# Altium schematic sheet FPGA_ADC_DAC.SchDoc: Phaser
size 420 x 297 mm; EDA_Number: ARTIQ; Projet: ARTIQ/SINARA; Author: G.Kasprowicz; CompanyName: WUT ISE; DrawnBy: G.Kasprowicz; Organization: WUT ISE; Address1: PW ISE; Address2: Nowowiejska 15/19 00-665 Warsaw; Address3: gkasprow@gmail.com; DocumentNumber: 8; Revision: 2; SheetNumber: 8; SheetTotal: 18; ModifiedBy: -; CheckedDate: -; Title2: FPGA DAC; DivGrp: WUT ISE; Designer: G.Kasprowicz; ModifiedDate: -; ProjectName: Sensor Box
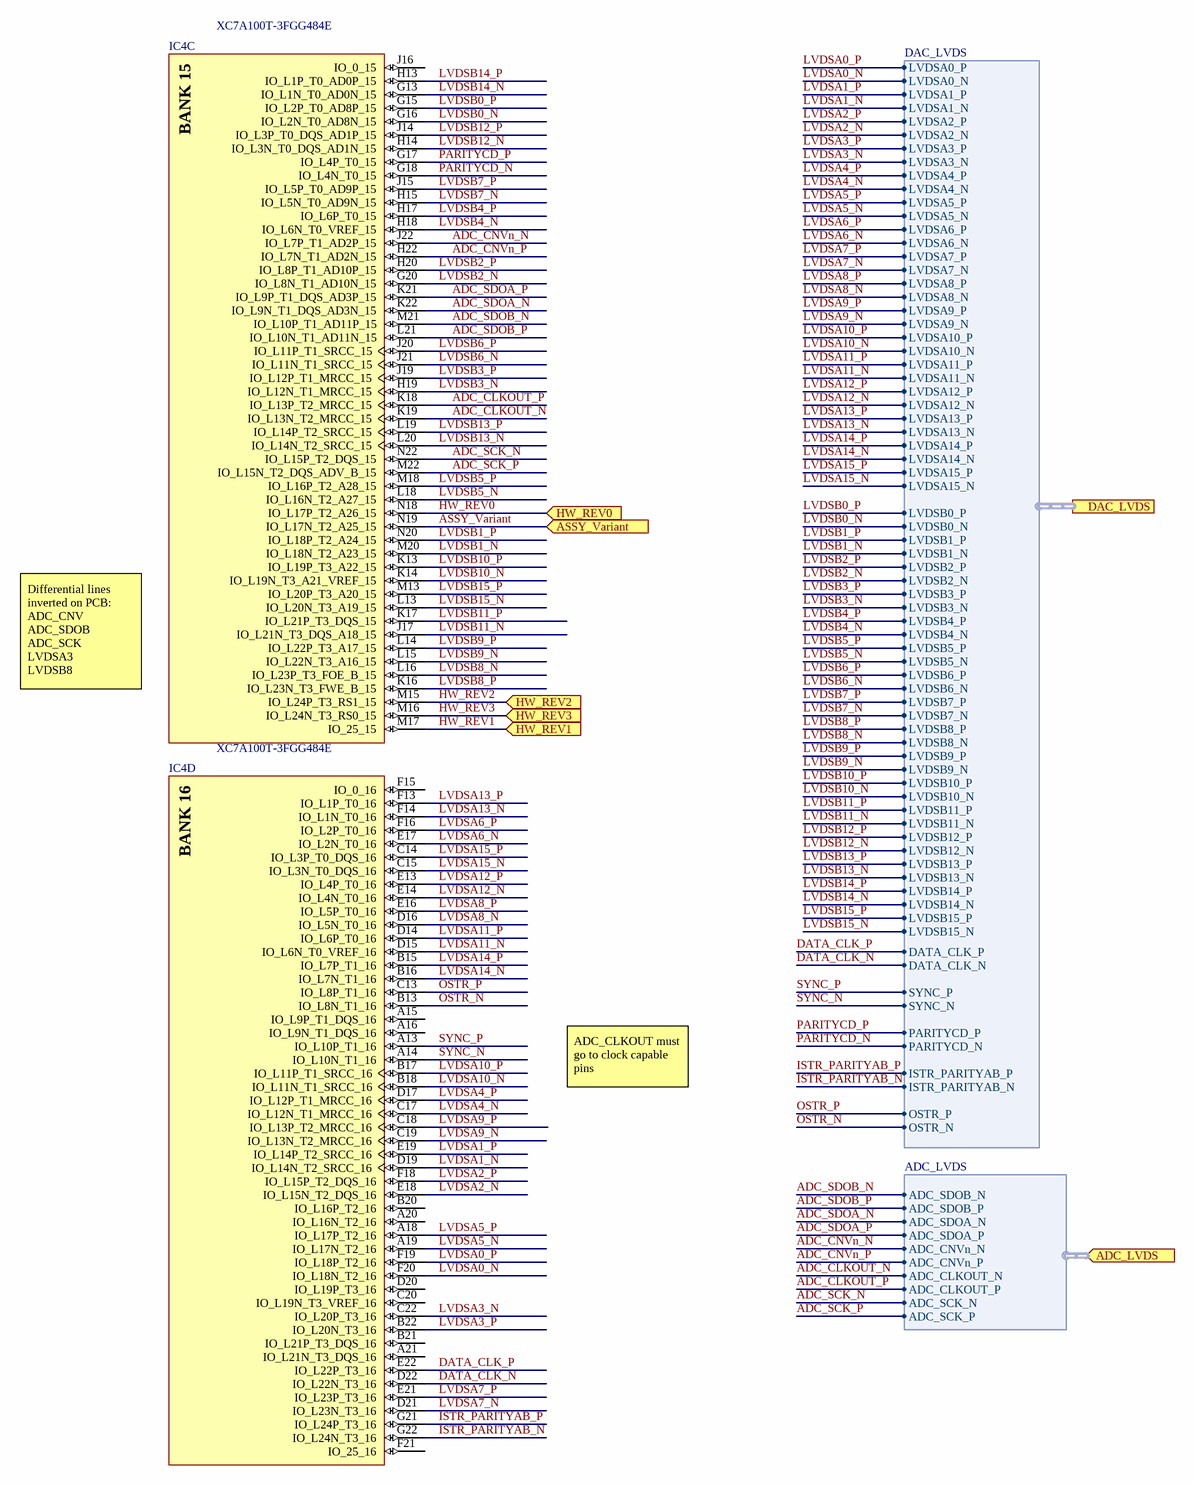
[diagram p0: FPGA_ADC_DAC.SchDoc]

## Parts
IC4  XC7A100T-3FGG484E  [FGG484]  (parts C,D of 10)

## Ports
ADC_LVDS (in, harness ADC_LVDS), ASSY_Variant (in), DAC_LVDS (harness DAC_LVDS), HW_REV0 (in), HW_REV1 (in), HW_REV2 (in), HW_REV3 (in)

## Harnesses
DAC_LVDS: LVDSA0_P, LVDSA0_N, LVDSA1_P, LVDSA1_N, LVDSA2_P, LVDSA2_N, LVDSA3_P, LVDSA3_N, LVDSA4_P, LVDSA4_N, LVDSA5_P, LVDSA5_N, LVDSA6_P, LVDSA6_N, LVDSA7_P, LVDSA7_N, LVDSA8_P, LVDSA8_N, LVDSA9_P, LVDSA9_N, LVDSA10_P, LVDSA10_N, LVDSA11_P, LVDSA11_N, LVDSA12_P, LVDSA12_N, LVDSA13_P, LVDSA13_N, LVDSA14_P, LVDSA14_N, LVDSA15_P, LVDSA15_N, LVDSB0_P, LVDSB0_N, LVDSB1_P, LVDSB1_N, LVDSB2_P, LVDSB2_N, LVDSB3_P, LVDSB3_N, LVDSB4_P, LVDSB4_N, LVDSB5_P, LVDSB5_N, LVDSB6_P, LVDSB6_N, LVDSB7_P, LVDSB7_N, LVDSB8_P, LVDSB8_N, LVDSB9_P, LVDSB9_N, LVDSB10_P, LVDSB10_N, LVDSB11_P, LVDSB11_N, LVDSB12_P, LVDSB12_N, LVDSB13_P, LVDSB13_N, LVDSB14_P, LVDSB14_N, LVDSB15_P, LVDSB15_N, DATA_CLK_P, DATA_CLK_N, SYNC_P, SYNC_N, PARITYCD_P, PARITYCD_N, ISTR_PARITYAB_P, ISTR_PARITYAB_N, OSTR_P, OSTR_N
ADC_LVDS: ADC_SDOB_N, ADC_SDOB_P, ADC_SDOA_N, ADC_SDOA_P, ADC_CNVn_N, ADC_CNVn_P, ADC_CLKOUT_N, ADC_CLKOUT_P, ADC_SCK_N, ADC_SCK_P

## Nets
ADC_CLKOUT_N: IC4.K19(IO_L13N_T2_MRCC_15) ; port ADC_LVDS.ADC_CLKOUT_N
ADC_CLKOUT_P: IC4.K18(IO_L13P_T2_MRCC_15) ; port ADC_LVDS.ADC_CLKOUT_P
ADC_CNVn_N: IC4.J22(IO_L7P_T1_AD2P_15) ; port ADC_LVDS.ADC_CNVn_N
ADC_CNVn_P: IC4.H22(IO_L7N_T1_AD2N_15) ; port ADC_LVDS.ADC_CNVn_P
ADC_SCK_N: IC4.N22(IO_L15P_T2_DQS_15) ; port ADC_LVDS.ADC_SCK_N
ADC_SCK_P: IC4.M22(IO_L15N_T2_DQS_ADV_B_15) ; port ADC_LVDS.ADC_SCK_P
ADC_SDOA_N: IC4.K22(IO_L9N_T1_DQS_AD3N_15) ; port ADC_LVDS.ADC_SDOA_N
ADC_SDOA_P: IC4.K21(IO_L9P_T1_DQS_AD3P_15) ; port ADC_LVDS.ADC_SDOA_P
ADC_SDOB_N: IC4.M21(IO_L10P_T1_AD11P_15) ; port ADC_LVDS.ADC_SDOB_N
ADC_SDOB_P: IC4.L21(IO_L10N_T1_AD11N_15) ; port ADC_LVDS.ADC_SDOB_P
ASSY_Variant: IC4.N19(IO_L17N_T2_A25_15) ; port ASSY_Variant
DATA_CLK_N: IC4.D22(IO_L22N_T3_16) ; port DAC_LVDS.DATA_CLK_N
DATA_CLK_P: IC4.E22(IO_L22P_T3_16) ; port DAC_LVDS.DATA_CLK_P
HW_REV0: IC4.N18(IO_L17P_T2_A26_15) ; port HW_REV0
HW_REV1: IC4.M17(IO_25_15) ; port HW_REV1
HW_REV2: IC4.M15(IO_L24P_T3_RS1_15) ; port HW_REV2
HW_REV3: IC4.M16(IO_L24N_T3_RS0_15) ; port HW_REV3
ISTR_PARITYAB_N: IC4.G22(IO_L24N_T3_16) ; port DAC_LVDS.ISTR_PARITYAB_N
ISTR_PARITYAB_P: IC4.G21(IO_L24P_T3_16) ; port DAC_LVDS.ISTR_PARITYAB_P
LVDSA0_N: IC4.F20(IO_L18N_T2_16) ; port DAC_LVDS.LVDSA0_N
LVDSA0_P: IC4.F19(IO_L18P_T2_16) ; port DAC_LVDS.LVDSA0_P
LVDSA1_N: IC4.D19(IO_L14N_T2_SRCC_16) ; port DAC_LVDS.LVDSA1_N
LVDSA1_P: IC4.E19(IO_L14P_T2_SRCC_16) ; port DAC_LVDS.LVDSA1_P
LVDSA2_N: IC4.E18(IO_L15N_T2_DQS_16) ; port DAC_LVDS.LVDSA2_N
LVDSA2_P: IC4.F18(IO_L15P_T2_DQS_16) ; port DAC_LVDS.LVDSA2_P
LVDSA3_N: IC4.C22(IO_L20P_T3_16) ; port DAC_LVDS.LVDSA3_N
LVDSA3_P: IC4.B22(IO_L20N_T3_16) ; port DAC_LVDS.LVDSA3_P
LVDSA4_N: IC4.C17(IO_L12N_T1_MRCC_16) ; port DAC_LVDS.LVDSA4_N
LVDSA4_P: IC4.D17(IO_L12P_T1_MRCC_16) ; port DAC_LVDS.LVDSA4_P
LVDSA5_N: IC4.A19(IO_L17N_T2_16) ; port DAC_LVDS.LVDSA5_N
LVDSA5_P: IC4.A18(IO_L17P_T2_16) ; port DAC_LVDS.LVDSA5_P
LVDSA6_N: IC4.E17(IO_L2N_T0_16) ; port DAC_LVDS.LVDSA6_N
LVDSA6_P: IC4.F16(IO_L2P_T0_16) ; port DAC_LVDS.LVDSA6_P
LVDSA7_N: IC4.D21(IO_L23N_T3_16) ; port DAC_LVDS.LVDSA7_N
LVDSA7_P: IC4.E21(IO_L23P_T3_16) ; port DAC_LVDS.LVDSA7_P
LVDSA8_N: IC4.D16(IO_L5N_T0_16) ; port DAC_LVDS.LVDSA8_N
LVDSA8_P: IC4.E16(IO_L5P_T0_16) ; port DAC_LVDS.LVDSA8_P
LVDSA9_N: IC4.C19(IO_L13N_T2_MRCC_16) ; port DAC_LVDS.LVDSA9_N
LVDSA9_P: IC4.C18(IO_L13P_T2_MRCC_16) ; port DAC_LVDS.LVDSA9_P
LVDSA10_N: IC4.B18(IO_L11N_T1_SRCC_16) ; port DAC_LVDS.LVDSA10_N
LVDSA10_P: IC4.B17(IO_L11P_T1_SRCC_16) ; port DAC_LVDS.LVDSA10_P
LVDSA11_N: IC4.D15(IO_L6N_T0_VREF_16) ; port DAC_LVDS.LVDSA11_N
LVDSA11_P: IC4.D14(IO_L6P_T0_16) ; port DAC_LVDS.LVDSA11_P
LVDSA12_N: IC4.E14(IO_L4N_T0_16) ; port DAC_LVDS.LVDSA12_N
LVDSA12_P: IC4.E13(IO_L4P_T0_16) ; port DAC_LVDS.LVDSA12_P
LVDSA13_N: IC4.F14(IO_L1N_T0_16) ; port DAC_LVDS.LVDSA13_N
LVDSA13_P: IC4.F13(IO_L1P_T0_16) ; port DAC_LVDS.LVDSA13_P
LVDSA14_N: IC4.B16(IO_L7N_T1_16) ; port DAC_LVDS.LVDSA14_N
LVDSA14_P: IC4.B15(IO_L7P_T1_16) ; port DAC_LVDS.LVDSA14_P
LVDSA15_N: IC4.C15(IO_L3N_T0_DQS_16) ; port DAC_LVDS.LVDSA15_N
LVDSA15_P: IC4.C14(IO_L3P_T0_DQS_16) ; port DAC_LVDS.LVDSA15_P
LVDSB0_N: IC4.G16(IO_L2N_T0_AD8N_15) ; port DAC_LVDS.LVDSB0_N
LVDSB0_P: IC4.G15(IO_L2P_T0_AD8P_15) ; port DAC_LVDS.LVDSB0_P
LVDSB1_N: IC4.M20(IO_L18N_T2_A23_15) ; port DAC_LVDS.LVDSB1_N
LVDSB1_P: IC4.N20(IO_L18P_T2_A24_15) ; port DAC_LVDS.LVDSB1_P
LVDSB2_N: IC4.G20(IO_L8N_T1_AD10N_15) ; port DAC_LVDS.LVDSB2_N
LVDSB2_P: IC4.H20(IO_L8P_T1_AD10P_15) ; port DAC_LVDS.LVDSB2_P
LVDSB3_N: IC4.H19(IO_L12N_T1_MRCC_15) ; port DAC_LVDS.LVDSB3_N
LVDSB3_P: IC4.J19(IO_L12P_T1_MRCC_15) ; port DAC_LVDS.LVDSB3_P
LVDSB4_N: IC4.H18(IO_L6N_T0_VREF_15) ; port DAC_LVDS.LVDSB4_N
LVDSB4_P: IC4.H17(IO_L6P_T0_15) ; port DAC_LVDS.LVDSB4_P
LVDSB5_N: IC4.L18(IO_L16N_T2_A27_15) ; port DAC_LVDS.LVDSB5_N
LVDSB5_P: IC4.M18(IO_L16P_T2_A28_15) ; port DAC_LVDS.LVDSB5_P
LVDSB6_N: IC4.J21(IO_L11N_T1_SRCC_15) ; port DAC_LVDS.LVDSB6_N
LVDSB6_P: IC4.J20(IO_L11P_T1_SRCC_15) ; port DAC_LVDS.LVDSB6_P
LVDSB7_N: IC4.H15(IO_L5N_T0_AD9N_15) ; port DAC_LVDS.LVDSB7_N
LVDSB7_P: IC4.J15(IO_L5P_T0_AD9P_15) ; port DAC_LVDS.LVDSB7_P
LVDSB8_N: IC4.L16(IO_L23P_T3_FOE_B_15) ; port DAC_LVDS.LVDSB8_N
LVDSB8_P: IC4.K16(IO_L23N_T3_FWE_B_15) ; port DAC_LVDS.LVDSB8_P
LVDSB9_N: IC4.L15(IO_L22N_T3_A16_15) ; port DAC_LVDS.LVDSB9_N
LVDSB9_P: IC4.L14(IO_L22P_T3_A17_15) ; port DAC_LVDS.LVDSB9_P
LVDSB10_N: IC4.K14(IO_L19N_T3_A21_VREF_15) ; port DAC_LVDS.LVDSB10_N
LVDSB10_P: IC4.K13(IO_L19P_T3_A22_15) ; port DAC_LVDS.LVDSB10_P
LVDSB11_N: IC4.J17(IO_L21N_T3_DQS_A18_15) ; port DAC_LVDS.LVDSB11_N
LVDSB11_P: IC4.K17(IO_L21P_T3_DQS_15) ; port DAC_LVDS.LVDSB11_P
LVDSB12_N: IC4.H14(IO_L3N_T0_DQS_AD1N_15) ; port DAC_LVDS.LVDSB12_N
LVDSB12_P: IC4.J14(IO_L3P_T0_DQS_AD1P_15) ; port DAC_LVDS.LVDSB12_P
LVDSB13_N: IC4.L20(IO_L14N_T2_SRCC_15) ; port DAC_LVDS.LVDSB13_N
LVDSB13_P: IC4.L19(IO_L14P_T2_SRCC_15) ; port DAC_LVDS.LVDSB13_P
LVDSB14_N: IC4.G13(IO_L1N_T0_AD0N_15) ; port DAC_LVDS.LVDSB14_N
LVDSB14_P: IC4.H13(IO_L1P_T0_AD0P_15) ; port DAC_LVDS.LVDSB14_P
LVDSB15_N: IC4.L13(IO_L20N_T3_A19_15) ; port DAC_LVDS.LVDSB15_N
LVDSB15_P: IC4.M13(IO_L20P_T3_A20_15) ; port DAC_LVDS.LVDSB15_P
OSTR_N: IC4.B13(IO_L8N_T1_16) ; port DAC_LVDS.OSTR_N
OSTR_P: IC4.C13(IO_L8P_T1_16) ; port DAC_LVDS.OSTR_P
PARITYCD_N: IC4.G18(IO_L4N_T0_15) ; port DAC_LVDS.PARITYCD_N
PARITYCD_P: IC4.G17(IO_L4P_T0_15) ; port DAC_LVDS.PARITYCD_P
SYNC_N: IC4.A14(IO_L10N_T1_16) ; port DAC_LVDS.SYNC_N
SYNC_P: IC4.A13(IO_L10P_T1_16) ; port DAC_LVDS.SYNC_P

Not connected (* = marked no-connect by the designer): IC4 A15(IO_L9P_T1_DQS_16) A16(IO_L9N_T1_DQS_16) A20(IO_L16N_T2_16) A21(IO_L21N_T3_DQS_16) B20(IO_L16P_T2_16) B21(IO_L21P_T3_DQS_16) C20(IO_L19N_T3_VREF_16) D20(IO_L19P_T3_16) F15(IO_0_16) F21(IO_25_16) J16(IO_0_15)

## Notes on the sheet
- Differential lines inverted on PCB:
  ADC_CNV
  ADC_SDOB
  ADC_SCK
  LVDSA3
  LVDSB8
- ADC_CLKOUT must go to clock capable pins
- Project/Equipment
- Document
- Designer
- Drawn by
- Check.by
- Copyright WUT ISE 2018.
  This documentation describes Open Hardware and is licensed under the CERN OHL v.1.1. You may redistribute and modify this documentation under the terms of the CERN OHL v.1.1. (http://ohwr.org/CERNOHL). This documentation is distributed WITHOUT ANY EXPRESS OR IMPLIED WARRANTY, INCLUDING OF MERCHANTABILITY, SATISFACTORY QUALITY AND FITNESS FOR A PARTICULAR PURPOSE. Please see the CERN OHL v.1.1 for applicable conditions.
- Contact
- File
- Last Mod.
- Print Date
- Sheet
- Size
- A3
- of
- Rev
- (in symbol CMP-0364-00028-3, part C) BANK 15
- (in symbol CMP-0364-00028-3, part D) BANK 16

## Library data of the parts
IC4 = CMP-0364-00028-3: Artix-7 FPGA, 285 User I/Os, 4 GTP, 484-Ball BGA, Speed Grade 3, Extended Grade, Pb-Free; Manufacturer: Xilinx; Max User I/O: 300; Clock Mgmt Tiles (CMTs): 6; Logic Cells: 101440; Block RAM Blocks (36Kb): 135; Block RAM Blocks (18Kb): 270; Speed Grade: -3; CLBs (Slices): 15850; Block RAM Blocks (Max Kb): 4860; DSP48E1 Slices: 240; RoHS: Pb-Free; ComponentLink3URL: http://www.xilinx.com/support/documentation/data_sheets/ds181_Artix_7_Data_Sheet.pdf; NexusDeviceID: XC7A100T-3FGG484E; DatasheetVersion: v1.12; Mounting Technology: Surface Mount; PackageDescription: Wire-Bond Fine-Pitch BGA, Body 23 x 23 mm, 1.0 mm Pitch; PackageReference: FGG484; ComponentLink2Description: Package Specification; Code_JEDEC: MS-034-AAJ-1; ComponentLink2URL: http://www.xilinx.com/support/documentation/user_guides/ug475_7Series_Pkg_Pinout.pdf; ComponentLink3Description: DC and Switching Characteristics; Generic Part Number: XC7A100T; ComponentLink4Description: Package File; ComponentLink4URL: http://www.xilinx.com/support/packagefiles/a7packages/xc7a100tfgg484pkg.txt; ComponentLink1URL: http://www.xilinx.com/support/documentation/data_sheets/ds180_7Series_Overview.pdf; PartNumber: XC7A100T-3FGG484E; ComponentLink5URL: http://www.xilinx.com/support/documentation/user_guides/ug475_7Series_Pkg_Pinout.pdf; PackageVersion: Rev 1.8; ComponentLink5Description: Packaging and Pinout; ComponentLink1Description: Datasheet; CLBs (Max Distributed RAM Kb): 1188